# EAGLE design steamer-mainboard (EAGLE 5.11)
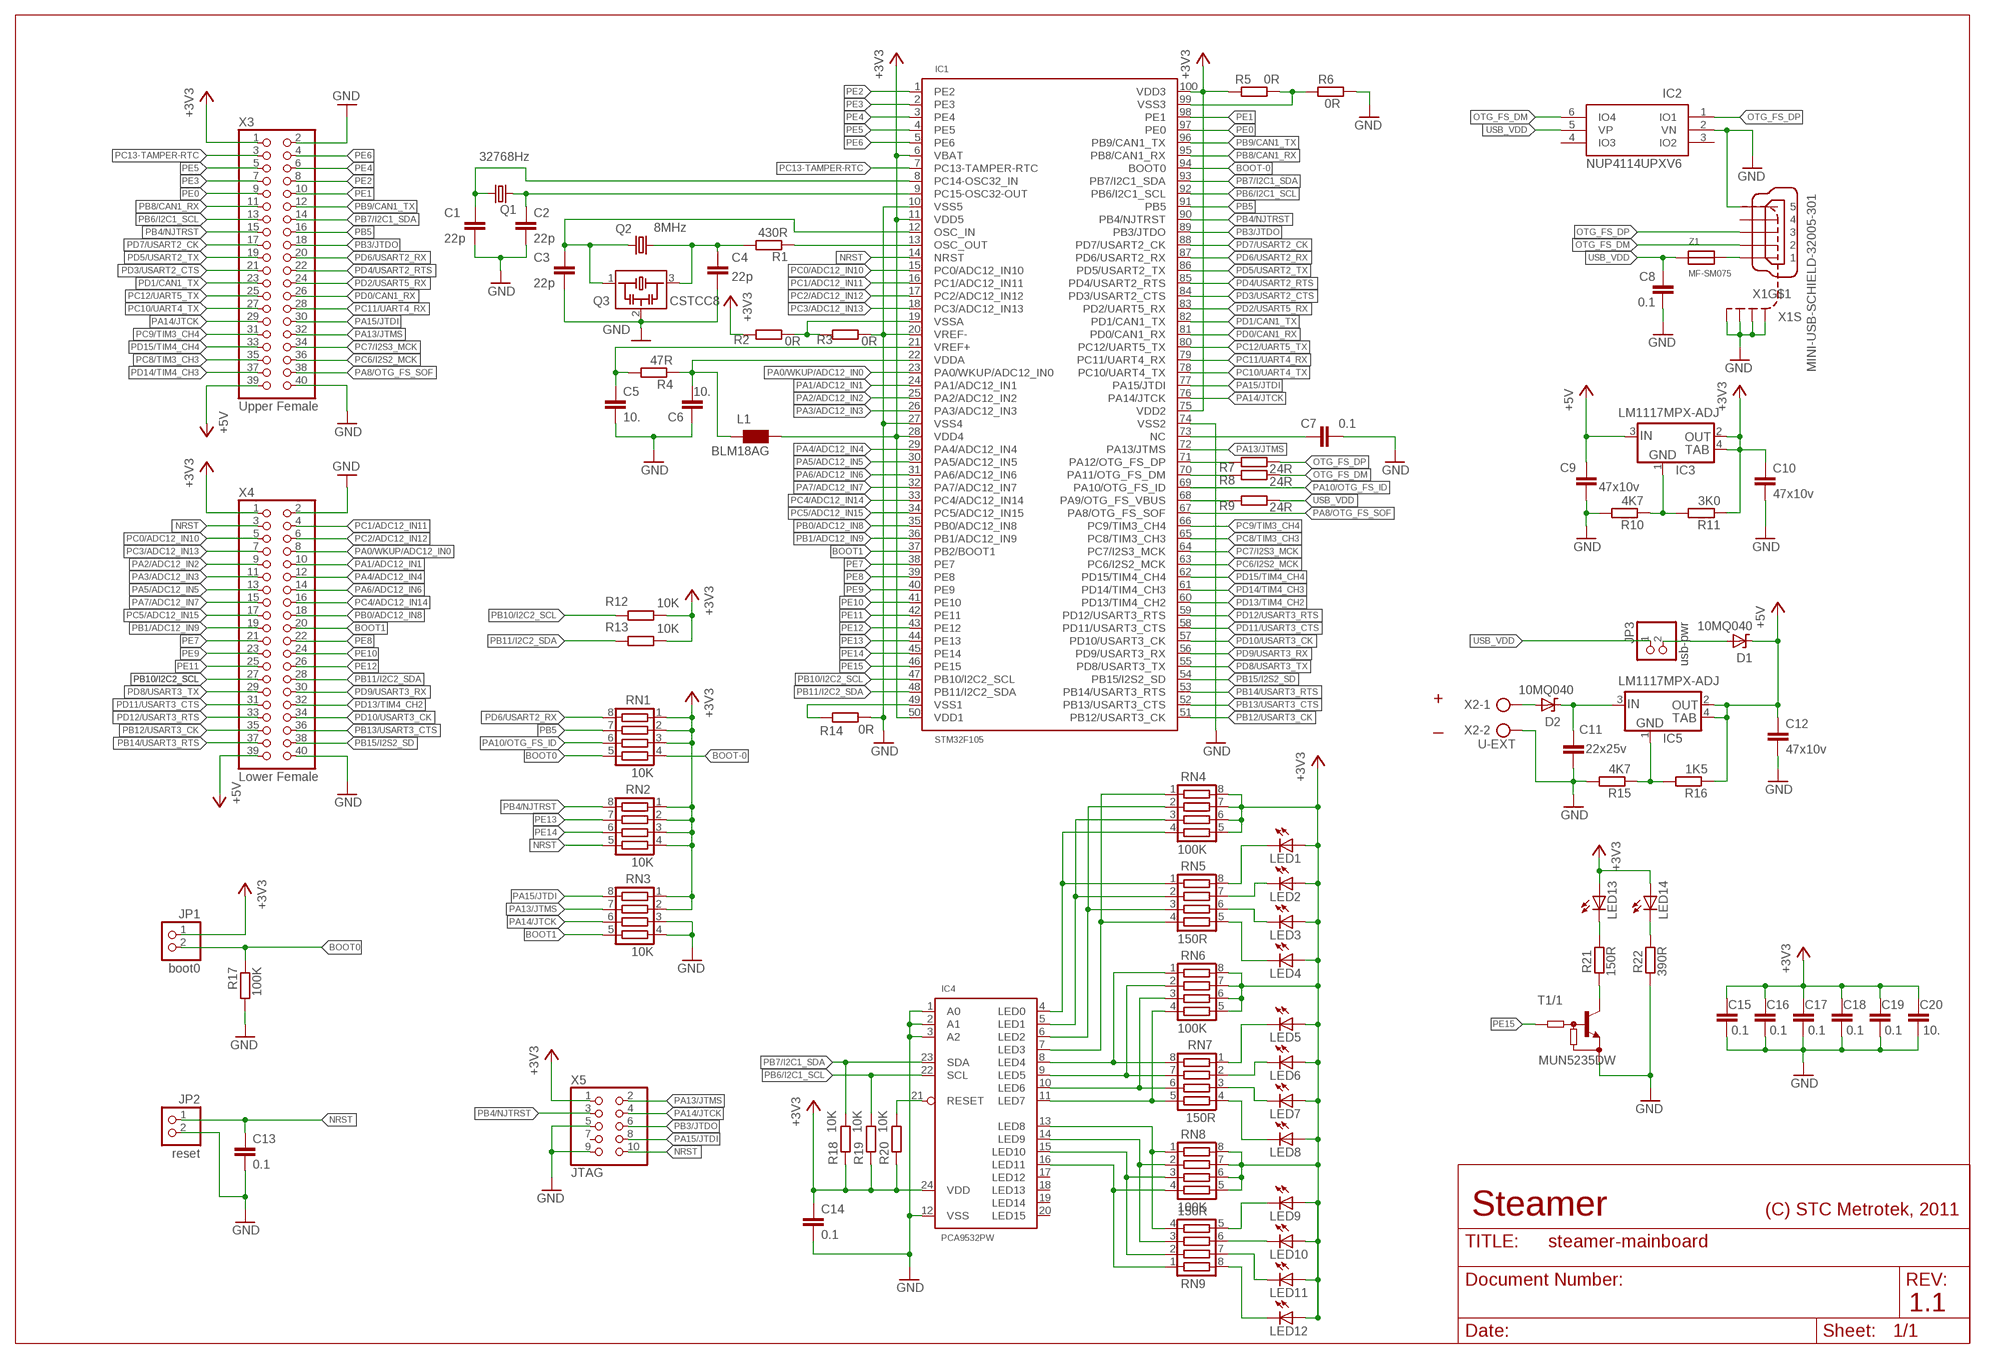
[diagram p0: schematic, sheet 1]

## Parts
C1  22p  C-EUC0603  [C0603]
C2  22p  C-EUC0603  [C0603]
C3  22p  C-EUC0603  [C0603]
C4  22p  C-EUC0603  [C0603]
C5  10.  C-EUC0603  [C0603]
C6  10.  C-EUC0603  [C0603]
C7  0.1  C-EUC0603  [C0603]
C8  0.1  C-EUC0603  [C0603]
C9  47x10v  C-EUC1210  [C1210]
C10  47x10v  C-EUC1210  [C1210]
C11  22x25v  C-EUC1210  [C1210]
C12  47x10v  C-EUC1210  [C1210]
C13  0.1  C-EUC0603  [C0603]
C14  0.1  C-EUC0603  [C0603]
C15  0.1  C-EUC0603  [C0603]
C16  0.1  C-EUC0603  [C0603]
C17  0.1  C-EUC0603  [C0603]
C18  0.1  C-EUC0603  [C0603]
C19  0.1  C-EUC0603  [C0603]
C20  10.  C-EUC0603  [C0603]
D1  10MQ040  [10MQ040]
D2  10MQ040  [10MQ040]
IC1  STM32F105  [TQFP100]
IC2  NUP4114UPXV6  [SOT-563]
IC3  LM1117MPX-ADJ  LM1117  [SOT223]
IC4  PCA9532PW  [TSSOP24]
IC5  LM1117MPX-ADJ  LM1117  [SOT223]
JP1  boot0  PINHD-1X2  [1X02]
JP2  reset  PINHD-1X2  [1X02]
JP3  usb-pwr  PINHD-1X2  [1X02]
L1  BLM18AG  WE-KIHC_0603  [WE-KI_0603_B]
LED1  LEDCHIPLED_0603  [CHIPLED_0603]
LED2  LEDCHIPLED_0603  [CHIPLED_0603]
LED3  LEDCHIPLED_0603  [CHIPLED_0603]
LED4  LEDCHIPLED_0603  [CHIPLED_0603]
LED5  LEDCHIPLED_0603  [CHIPLED_0603]
LED6  LEDCHIPLED_0603  [CHIPLED_0603]
LED7  LEDCHIPLED_0603  [CHIPLED_0603]
LED8  LEDCHIPLED_0603  [CHIPLED_0603]
LED9  LEDCHIPLED_0603  [CHIPLED_0603]
LED10  LEDCHIPLED_0603  [CHIPLED_0603]
LED11  LEDCHIPLED_0603  [CHIPLED_0603]
LED12  LEDCHIPLED_0603  [CHIPLED_0603]
LED13  LEDCHIPLED_0603  [CHIPLED_0603]
LED14  LEDCHIPLED_0603  [CHIPLED_0603]
Q1  32768Hz  CRYTALTC26H  [TC26H]
Q2  8MHz  CRYTALHC49U-V  [HC49U-V]
Q3  CSTCC8  [CSTCC8]
R1  430R  R-EU_R0603  [R0603]
R2  0R  R-EU_R0603  [R0603]
R3  0R  R-EU_R0603  [R0603]
R4  47R  R-EU_R0603  [R0603]
R5  0R  R-EU_R0603  [R0603]
R6  0R  R-EU_R0603  [R0603]
R7  24R  R-EU_R0603  [R0603]
R8  24R  R-EU_R0603  [R0603]
R9  24R  R-EU_R0603  [R0603]
R10  4K7  R-EU_R0603  [R0603]
R11  3K0  R-EU_R0603  [R0603]
R12  10K  R-EU_R0603  [R0603]
R13  10K  R-EU_R0603  [R0603]
R14  0R  R-EU_R0603  [R0603]
R15  4K7  R-EU_R0603  [R0603]
R16  1K5  R-EU_R0603  [R0603]
R17  100K  R-EU_R0603  [R0603]
R18  10K  R-EU_R0603  [R0603]
R19  10K  R-EU_R0603  [R0603]
R20  10K  R-EU_R0603  [R0603]
R21  150R  R-EU_R0603  [R0603]
R22  390R  R-EU_R0603  [R0603]
RN1  10K  CTS742C083  [CTS742C083]
RN2  10K  CTS742C083  [CTS742C083]
RN3  10K  CTS742C083  [CTS742C083]
RN4  100K  CTS742C083  [CTS742C083]
RN5  150R  CTS742C083  [CTS742C083]
RN6  100K  CTS742C083  [CTS742C083]
RN7  150R  CTS742C083  [CTS742C083]
RN8  100K  CTS742C083  [CTS742C083]
RN9  150R  CTS742C083  [CTS742C083]
T1  MUN5235DW  [SOT363_INFINEON]
X1  MINI-USB-SCHIELD-32005-301  [32005-301]
X2  U-EXT  AK500/2  [AK500/2]
X3  Upper Female  PINHD-2X20BROWNBEAR-F  [2X20SMD1-27-BB]
X4  Lower Female  PINHD-2X20BROWNBEAR-F  [2X20SMD1-27-BB]
X5  JTAG  PINHD-2X5  [2X05]
Z1  MF-SM075  [MF-SM075]

## Nets
+3V3 [+3V3]: C10.1 C14.1 C15.1 C16.1 C17.1 C18.1 C19.1 C20.1 IC1.6(VBAT) IC1.11(VDD5) IC1.28(VDD4) IC1.50(VDD1) IC1.75(VDD2) IC1.100(VDD3) IC3.2(OUT) IC3.4(TAB) IC4.24(VDD) JP1.1 L1.1 LED1.A LED2.A LED3.A LED4.A LED5.A LED6.A LED7.A LED8.A LED9.A LED10.A LED11.A LED12.A LED13.A LED14.A R2.2 R5.1 R11.1 R12.1 R13.1 R18.1 R19.1 R20.1 RN1.1 RN1.2 RN1.3 RN2.1 RN2.2 RN2.3 RN2.4 RN3.1 RN3.2 RN4.5 RN4.6 RN4.7 RN4.8 RN6.5 RN6.6 RN6.7 RN6.8 RN8.5 RN8.6 RN8.7 RN8.8 X3.1 X4.1 X5.1
+5V [+5V]: C9.1 C12.1 D1.P$1(C) IC3.3(IN) IC5.2(OUT) IC5.4(TAB) R16.1 X3.39 X4.39
BOOT0: JP1.2 R17.1 RN1.5
BOOT1: IC1.37(PB2/BOOT1) RN3.5 X4.20
BOOT-0: IC1.94(BOOT0) RN1.4
GND [GND]: C1.2 C2.2 C3.2 C4.2 C5.2 C6.2 C7.2 C8.2 C9.2 C10.2 C11.2 C12.2 C13.2 C14.2 C15.2 C16.2 C17.2 C18.2 C19.2 C20.2 IC1.10(VSS5) IC1.20(VREF-) IC1.27(VSS4) IC1.74(VSS2) IC2.2(VN) IC4.1(A0) IC4.2(A1) IC4.3(A2) IC4.12(VSS) JP2.2 Q3.2 R3.1 R6.2 R10.2 R14.2 R15.2 R17.2 R22.1 RN3.3 RN3.4 T1.4(/1:E) X1.5 X1.M1(S:S1) X1.M2(S:S2) X1.M3(S:S3) X1.M4(S:S4) X2.2 X3.2 X3.40 X4.2 X4.40 X5.5 X5.9
N$1: C1.1 IC1.8(PC14-OSC32_IN) Q1.2
N$2: C2.1 IC1.9(PC15-OSC32-OUT) Q1.1
N$3 [USB_VDD]: X1.1 Z1.P$2
N$4: LED2.C RN5.7
N$5: C3.1 IC1.12(OSC_IN) Q2.1 Q3.1
N$6: C4.1 Q2.2 Q3.3 R1.2
N$7: IC4.7(LED3) RN4.1 RN5.4
N$8: IC4.6(LED2) RN4.2 RN5.3
N$9 [+3V3]: C6.1 IC1.22(VDDA) L1.2 R4.1
N$10 [+3V3]: C5.1 IC1.21(VREF+) R4.2
N$11: IC1.71(PA12/OTG_FS_DP) R7.2
N$12: IC1.70(PA11/OTG_FS_DM) R8.2
N$13: IC1.68(PA9/OTG_FS_VBUS) R9.2
N$14: IC3.1(GND) R10.1 R11.2
N$15: IC4.5(LED1) RN4.3 RN5.2
N$16: IC4.4(LED0) RN4.4 RN5.1
N$17: LED3.C RN5.6
N$18: LED1.C RN5.8
N$19: LED4.C RN5.5
N$20: IC1.13(OSC_OUT) R1.1
N$21: LED6.C RN7.2
N$22: LED7.C RN7.3
N$23: LED5.C RN7.1
N$24: LED8.C RN7.4
N$25: LED11.C RN9.7
N$26: LED10.C RN9.6
N$27: LED12.C RN9.8
N$28: LED9.C RN9.5
N$29 [GND]: C7.1 IC1.73(NC)
N$30 [GND]: IC1.49(VSS1) R14.1
N$31 [GND]: IC1.99(VSS3) R5.2 R6.1
N$32: IC4.8(LED4) RN6.1 RN7.8
N$33: IC4.9(LED5) RN6.2 RN7.7
N$34: IC4.10(LED6) RN6.3 RN7.6
N$35: IC4.11(LED7) RN6.4 RN7.5
N$36: IC4.13(LED8) RN8.1 RN9.4
N$37: IC4.14(LED9) RN8.2 RN9.3
N$38: IC4.15(LED10) RN8.3 RN9.2
N$39: IC4.16(LED11) RN8.4 RN9.1
N$40: IC4.21(RESET) R20.2
N$41: LED13.C R21.2
N$42 [USB_VDD]: D1.P$2(A) JP3.2
N$43 [SUPP]: C11.1 D2.P$1(C) IC5.3(IN)
N$44 [SUPP]: D2.P$2(A) X2.1
N$45: LED14.C R22.2
N$46: R21.1 T1.3(/1:C)
N$47 [GND]: IC1.19(VSSA) R2.1 R3.2
N$48: IC5.1(GND) R15.1 R16.2
NRST: C13.1 IC1.14(NRST) JP2.1 RN2.5 X4.3 X5.10
OTG_FS_DM: IC2.6(IO4) R8.1 X1.2
OTG_FS_DP: IC2.1(IO1) R7.1 X1.3
PA0/WKUP/ADC12_IN0: IC1.23(PA0/WKUP/ADC12_IN0) X4.8
PA1/ADC12_IN1: IC1.24(PA1/ADC12_IN1) X4.10
PA2/ADC12_IN2: IC1.25(PA2/ADC12_IN2) X4.9
PA3/ADC12_IN3: IC1.26(PA3/ADC12_IN3) X4.11
PA4/ADC12_IN4: IC1.29(PA4/ADC12_IN4) X4.12
PA5/ADC12_IN5: IC1.30(PA5/ADC12_IN5) X4.13
PA6/ADC12_IN6: IC1.31(PA6/ADC12_IN6) X4.14
PA7/ADC12_IN7: IC1.32(PA7/ADC12_IN7) X4.15
PA8/OTG_FS_SOF: IC1.67(PA8/OTG_FS_SOF) X3.38
PA10/OTG_FS_ID: IC1.69(PA10/OTG_FS_ID) RN1.6
PA13/JTMS: IC1.72(PA13/JTMS) RN3.7 X3.32 X5.2
PA14/JTCK: IC1.76(PA14/JTCK) RN3.6 X3.29 X5.4
PA15/JTDI: IC1.77(PA15/JTDI) RN3.8 X3.30 X5.8
PB0/ADC12_IN8: IC1.35(PB0/ADC12_IN8) X4.18
PB1/ADC12_IN9: IC1.36(PB1/ADC12_IN9) X4.19
PB3/JTDO: IC1.89(PB3/JTDO) X3.18 X5.6
PB4/NJTRST: IC1.90(PB4/NJTRST) RN2.8 X3.15 X5.3
PB5: IC1.91(PB5) RN1.7 X3.16
PB6/I2C1_SCL: IC1.92(PB6/I2C1_SCL) IC4.22(SCL) R19.2 X3.13
PB7/I2C1_SDA: IC1.93(PB7/I2C1_SDA) IC4.23(SDA) R18.2 X3.14
PB8/CAN1_RX: IC1.95(PB8/CAN1_RX) X3.11
PB9/CAN1_TX: IC1.96(PB9/CAN1_TX) X3.12
PB10/I2C2_SCL: IC1.47(PB10/I2C2_SCL) R12.2 X4.27
PB11/I2C2_SDA: IC1.48(PB11/I2C2_SDA) R13.2 X4.28
PB12/USART3_CK: IC1.51(PB12/USART3_CK) X4.35
PB13/USART3_CTS: IC1.52(PB13/USART3_CTS) X4.36
PB14/USART3_RTS: IC1.53(PB14/USART3_RTS) X4.37
PB15/I2S2_SD: IC1.54(PB15/I2S2_SD) X4.38
PC0/ADC12_IN10: IC1.15(PC0/ADC12_IN10) X4.5
PC1/ADC12_IN11: IC1.16(PC1/ADC12_IN11) X4.4
PC2/ADC12_IN12: IC1.17(PC2/ADC12_IN12) X4.6
PC3/ADC12_IN13: IC1.18(PC3/ADC12_IN13) X4.7
PC4/ADC12_IN14: IC1.33(PC4/ADC12_IN14) X4.16
PC5/ADC12_IN15: IC1.34(PC5/ADC12_IN15) X4.17
PC6/I2S2_MCK: IC1.63(PC6/I2S2_MCK) X3.36
PC7/I2S3_MCK: IC1.64(PC7/I2S3_MCK) X3.34
PC8/TIM3_CH3: IC1.65(PC8/TIM3_CH3) X3.35
PC9/TIM3_CH4: IC1.66(PC9/TIM3_CH4) X3.31
PC10/UART4_TX: IC1.78(PC10/UART4_TX) X3.27
PC11/UART4_RX: IC1.79(PC11/UART4_RX) X3.28
PC12/UART5_TX: IC1.80(PC12/UART5_TX) X3.25
PC13-TAMPER-RTC: IC1.7(PC13-TAMPER-RTC) X3.3
PD0/CAN1_RX: IC1.81(PD0/CAN1_RX) X3.26
PD1/CAN1_TX: IC1.82(PD1/CAN1_TX) X3.23
PD2/USART5_RX: IC1.83(PD2/UART5_RX) X3.24
PD3/USART2_CTS: IC1.84(PD3/USART2_CTS) X3.21
PD4/USART2_RTS: IC1.85(PD4/USART2_RTS) X3.22
PD5/USART2_TX: IC1.86(PD5/USART2_TX) X3.19
PD6/USART2_RX: IC1.87(PD6/USART2_RX) RN1.8 X3.20
PD7/USART2_CK: IC1.88(PD7/USART2_CK) X3.17
PD8/USART3_TX: IC1.55(PD8/USART3_TX) X4.29
PD9/USART3_RX: IC1.56(PD9/USART3_RX) X4.30
PD10/USART3_CK: IC1.57(PD10/USART3_CK) X4.34
PD11/USART3_CTS: IC1.58(PD11/USART3_CTS) X4.31
PD12/USART3_RTS: IC1.59(PD12/USART3_RTS) X4.33
PD13/TIM4_CH2: IC1.60(PD13/TIM4_CH2) X4.32
PD14/TIM4_CH3: IC1.61(PD14/TIM4_CH3) X3.37
PD15/TIM4_CH4: IC1.62(PD15/TIM4_CH4) X3.33
PE0: IC1.97(PE0) X3.9
PE1: IC1.98(PE1) X3.10
PE2: IC1.1(PE2) X3.8
PE3: IC1.2(PE3) X3.7
PE4: IC1.3(PE4) X3.6
PE5: IC1.4(PE5) X3.5
PE6: IC1.5(PE6) X3.4
PE7: IC1.38(PE7) X4.21
PE8: IC1.39(PE8) X4.22
PE9: IC1.40(PE9) X4.23
PE10: IC1.41(PE10) X4.24
PE11: IC1.42(PE11) X4.25
PE12: IC1.43(PE12) X4.26
PE13: IC1.44(PE13) RN2.7
PE14: IC1.45(PE14) RN2.6
PE15: IC1.46(PE15) T1.5(/1:B)
USB_VDD [USB_VDD]: C8.1 IC2.5(VP) JP3.1 R9.1 Z1.P$1
Unconnected: IC2.3(IO2) IC2.4(IO3) IC4.17(LED12) IC4.18(LED13) IC4.19(LED14) IC4.20(LED15) T1.1(/2:E) T1.2(/2:B) T1.6(/2:C) X1.4 X5.7

## Notes on the sheet
- +
- _
- Steamer | (C) STC Metrotek, 2011
- 1.1

## Library data of the parts
C1-C20 = rcl:C-EU: CAPACITOR, European symbol
D1 D2 = 10mq040:10MQ040
IC1 = stm32f105:STM32F105
IC2 = nup4114upx:NUP4114UPXV6
IC3 IC5 = lm1117:LM1117
IC4 = pca9532pw:PCA9532
JP1-JP3 = pinhead:PINHD-1X2: PIN HEADER
L1 = wuerth-elektronik:WE-KIHC: SMD Wire Wound Ceramic Inductor WE-KIHC - High current up to 2400 mA - Very high Q values - High thermal stability - Very high SRF - up to 12,5 GHz -- Bluetooth -- Wireless LAN -- RF oscillation circuit -- IF impedance matching -- PA chokes
LED1-LED14 = led:LED: LED OSRAM: - CHIPLED LG R971, LG N971, LY N971, LG Q971, LY Q971, LO R971, LY R971 LH N974, LH R974 LS Q976, LO Q976, LY Q976 LO Q996 - Hyper CHIPLED LW Q18S LB Q993, LB Q99A, LB R99A - SideLED LS A670, LO A670, LY A670, LG A670, LP A670 LB A673, LV A673, LT A673, LW A673 LH A674 LY A675 LS A676, LA A676, LO A676, LY A676, LW A676 LS A679, LY A679, LG A679 - Hyper Micro SIDELED® LS Y876, LA Y876, LO Y876, LY Y876 LT Y87S - SmartLED LW L88C, LW L88S LB L89C, LB L89S, LG L890 LS L89K, LO L89K, LY L89K LS L896, LA L896, LO L896, LY L896 - TOPLED LS T670, LO T670, LY T670, LG T670, LP T670 LSG T670, LSP T670, LSY T670, LOP T670, LYG T670 LG T671, LOG T671, LSG T671 LB T673, LV T673, LT T673, LW T673 LH T674 LS T676, LA T676, LO T676, LY T676, LB T676, LH T676, LSB T676, LW T676 LB T67C, LV T67C, LT T67C, LS T67K, LO T67K, LY T67K, LW E67C LS E67B, LA E67B, LO E67B, LY E67B, LB E67C, LV E67C, LT E67C LW T67C LS T679, LY T679, LG T679 LS T770, LO T770, LY T770, LG T770, LP T770 LB T773, LV T773, LT T773, LW T773 LH T774 LS E675, LA E675, LY E675, LS T675 LS T776, LA T776, LO T776, LY T776, LB T776 LHGB T686 LT T68C, LB T68C - Hyper Mini TOPLED® LB M676 - Mini TOPLED Santana® LG M470 LS M47K, LO M47K, LY M47K Source: http://www.osram.convergy.de LUXEON: - LUMILED® LXK2-PW12-R00, LXK2-PW12-S00, LXK2-PW14-U00, LXK2-PW14-V00 LXK2-PM12-R00, LXK2-PM12-S00, LXK2-PM14-U00 LXK2-PE12-Q00, LXK2-PE12-R00, LXK2-PE12-S00, LXK2-PE14-T00, LXK2-PE14-U00 LXK2-PB12-K00, LXK2-PB12-L00, LXK2-PB12-M00, LXK2-PB14-N00, LXK2-PB14-P00, LXK2-PB14-Q00 LXK2-PR12-L00, LXK2-PR12-M00, LXK2-PR14-Q00, LXK2-PR14-R00 LXK2-PD12-Q00, LXK2-PD12-R00, LXK2-PD12-S00 LXK2-PH12-R00, LXK2-PH12-S00 LXK2-PL12-P00, LXK2-PL12-Q00, LXK2-PL12-R00 Source: www.luxeon.com KINGBRIGHT: KA-3528ASYC Source: www.kingbright.com
Q1 Q2 = crystal:CRYTAL: CRYSTAL
Q3 = cstcc8:CSTCC8: Murata rezonator
R1-R22 = rcl:R-EU_: RESISTOR, European symbol
RN1-RN9 = chip-resistor-net:CTS742C083: Chip Resistor Array 4 Single Resistor Source: http://www.ctscorp.com/components/Datasheets/CTSChipArrayDs.pdf
T1 = mun5235:MUN5235DW
X1 = miniusb:MINI-USB-SCHIELD-: MINI USB-B Conector Source: www.cypressindustries.com
X2 = con-ptr500:AK500/2: CONNECTOR
X3 X4 = con-pinhd-2x20:PINHD-2X20: PIN HEADER
X5 = steamer:PINHD-2X5: PIN HEADER
Z1 = mf-sm075:MF-SM075

## Net classes
0 default: width 0.102 mm
1 GND: width 0.254 mm
2 +3V3: width 0.254 mm
3 +5V: width 0.254 mm
4 USB_VDD: width 0.254 mm
5 SUPP: width 0.305 mm

## Board
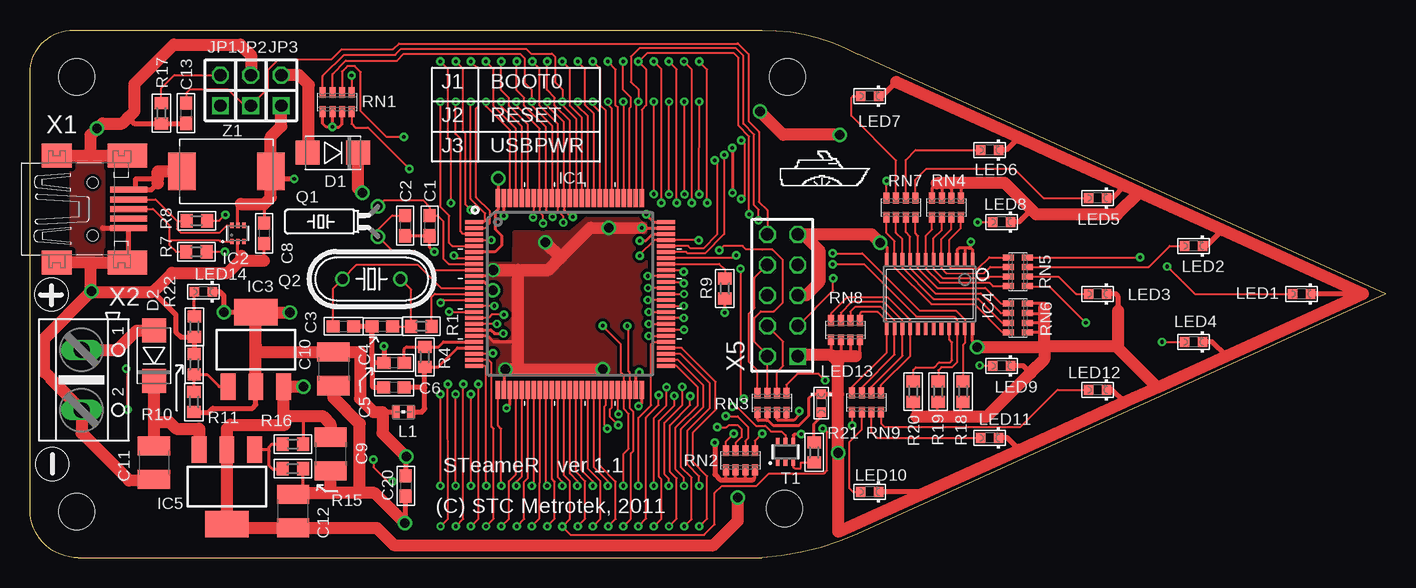
[diagram p1: board, top side]
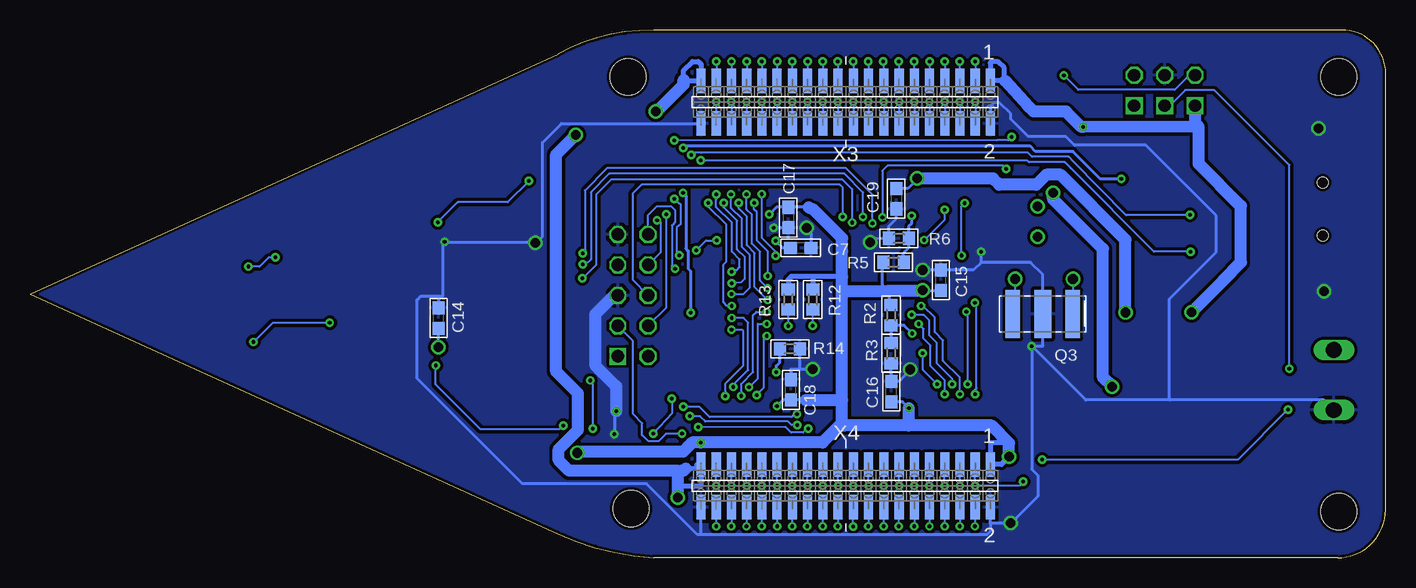
[diagram p2: board, bottom side, seen from below]

Size 113 x 44.02 mm. Coordinates in mm from the lower left corner, seen from the top.
Outline: 0,4 0,40.75 arc-90 4,44 61,44 arc-30 69,42 113,22 69,2 arc-21 61,0 4,0 arc-90 0,4
Copper layers (1*16): Top 0.035mm / dielectric 1.43mm / Bottom 0.035mm
Design rules "default *": minimum track width 0.18mm, minimum drill 0.3mm, track to track 0.2mm, track to pad 0.18mm, pad to pad 0.1mm, via to via 0.18mm, smd to smd 0.2mm, copper to edge 0.25mm, drill to drill 0.3mm, minimum pad ring 0.2mm, minimum via ring 0.2mm, stop-mask expansion 0.1mm, vias tented up to drill 0.4mm, thermal gap 12mil
Holes 3 mm at 62.9,4.1 63.15,40.1 3.9,3.85 3.9,40.1
tRestrict: area 62.1,28.6 to 70.4,34.4

### Footprints (pad centres in the part's own frame; a part is rotated, then mirrored left to right if it is on the bottom)
C0603 = smd 1.1 x 1: 1 -0.85,0; 2 0.85,0
C1210 = smd 1.6 x 2.7: 1 -1.4,0; 2 1.4,0
10MQ040 = smd 2 x 2: P$1 -2.1,0; P$2 2.1,0
TQFP100 = smd 1.5 x 0.35: 1 -8,6; 2 -8,5.5; 3 -8,5; 4 -8,4.5; 5 -8,4; 6 -8,3.5; 7 -8,3; 8 -8,2.5; 9 -8,2; 10 -8,1.5; 11 -8,1; 12 -8,0.5; 13 -8,0; 14 -8,-0.5; 15 -8,-1; 16 -8,-1.5; 17 -8,-2; 18 -8,-2.5; 19 -8,-3; 20 -8,-3.5; 21 -8,-4; 22 -8,-4.5; 23 -8,-5; 24 -8,-5.5; 25 -8,-6; 51 8,-6; 52 8,-5.5; 53 8,-5; 54 8,-4.5; 55 8,-4; 56 8,-3.5; 57 8,-3; 58 8,-2.5; 59 8,-2; 60 8,-1.5; 61 8,-1; 62 8,-0.5; 63 8,0; 64 8,0.5; 65 8,1; 66 8,1.5; 67 8,2; 68 8,2.5; 69 8,3; 70 8,3.5; 71 8,4; 72 8,4.5; 73 8,5; 74 8,5.5; 75 8,6 | smd 0.35 x 1.5: 26 -6,-8; 27 -5.5,-8; 28 -5,-8; 29 -4.5,-8; 30 -4,-8; 31 -3.5,-8; 32 -3,-8; 33 -2.5,-8; 34 -2,-8; 35 -1.5,-8; 36 -1,-8; 37 -0.5,-8; 38 0,-8; 39 0.5,-8; 40 1,-8; 41 1.5,-8; 42 2,-8; 43 2.5,-8; 44 3,-8; 45 3.5,-8; 46 4,-8; 47 4.5,-8; 48 5,-8; 49 5.5,-8; 50 6,-8; 76 6,8; 77 5.5,8; 78 5,8; 79 4.5,8; 80 4,8; 81 3.5,8; 82 3,8; 83 2.5,8; 84 2,8; 85 1.5,8; 86 1,8; 87 0.5,8; 88 0,8; 89 -0.5,8; 90 -1,8; 91 -1.5,8; 92 -2,8; 93 -2.5,8; 94 -3,8; 95 -3.5,8; 96 -4,8; 97 -4.5,8; 98 -5,8; 99 -5.5,8; 100 -6,8
SOT-563 = smd 0.3 x 0.45: 1 -0.5,-0.675; 2 0,-0.675; 3 0.5,-0.675; 4 0.5,0.675; 5 0,0.675; 6 -0.5,0.675
SOT223 = smd 1.219 x 2.235: 1 -2.311,-3.099; 2 0,-3.099; 3 2.311,-3.099 | smd 3.6 x 2.2: 4 0,3.099
TSSOP24 = smd 0.305 x 0.991: 1 -3.575,-2.918; 2 -2.925,-2.918; 3 -2.275,-2.918; 4 -1.625,-2.918; 5 -0.975,-2.918; 6 -0.325,-2.918; 7 0.325,-2.918; 8 0.975,-2.918; 9 1.625,-2.918; 10 2.275,-2.918; 11 2.925,-2.918; 12 3.575,-2.918; 13 3.575,2.918; 14 2.925,2.918; 15 2.275,2.918; 16 1.625,2.918; 17 0.975,2.918; 18 0.325,2.918; 19 -0.325,2.918; 20 -0.975,2.918; 21 -1.625,2.918; 22 -2.275,2.918; 23 -2.925,2.918; 24 -3.575,2.918
1X02 = drill 1.016 square: 1 -1.27,0 | drill 1.016 octagon: 2 1.27,0
WE-KI_0603_B = smd 0.64 x 1.02: 1 -0.64,0; 2 0.64,0
CHIPLED_0603 = smd 0.8 x 0.8: A 0,-0.75; C 0,0.75
TC26H = drill 0.813 round: 1 -1.27,0; 2 1.27,0
HC49U-V = drill 0.813 round: 1 -2.413,0; 2 2.413,0
CSTCC8 = smd 1.2 x 4: 1 -2.5,0; 3 2.5,0 | smd 1.4 x 4: 2 0,0
R0603 = smd 1 x 1.1: 1 -0.85,0; 2 0.85,0
CTS742C083 = smd 0.5 x 0.9: 1 -1.2,-0.8; 2 -0.4,-0.8; 3 0.4,-0.8; 4 1.2,-0.8; 5 1.2,0.8; 6 0.4,0.8; 7 -0.4,0.8; 8 -1.2,0.8
SOT363_INFINEON = smd 0.3 x 0.7: 1 -0.65,-0.8; 2 0,-0.8; 3 0.65,-0.8; 4 0.65,0.8; 5 0,0.8; 6 -0.65,0.8
32005-301 = smd 3.1 x 0.5: 1 3,1.6; 2 3,0.8; 3 3,0; 4 3,-0.8; 5 3,-1.6 | smd 2.5 x 2: M1 -3,-4.45; M2 -3,4.45 | smd 3.3 x 2: M3 2.9,4.45; M4 2.9,-4.45 | hole 0.9: 0,2.2; 0,-2.2
AK500/2 = drill 1.321 long: 1 -2.515,0; 2 2.515,0
2X20SMD1-27-BB = smd 0.76 x 2.05: 1 -12.065,-1.775; 2 -12.065,1.775; 3 -10.795,-1.775; 4 -10.795,1.775; 5 -9.525,-1.775; 6 -9.525,1.775; 7 -8.255,-1.775; 8 -8.255,1.775; 9 -6.985,-1.775; 10 -6.985,1.775; 11 -5.715,-1.775; 12 -5.715,1.775; 13 -4.455,-1.775; 14 -4.455,1.775; 15 -3.175,-1.775; 16 -3.175,1.775; 17 -1.905,-1.775; 18 -1.905,1.775; 19 -0.635,-1.775; 20 -0.635,1.775; 21 0.635,-1.775; 22 0.635,1.775; 23 1.905,-1.775; 24 1.905,1.775; 25 3.175,-1.775; 26 3.175,1.775; 27 4.445,-1.775; 28 4.445,1.775; 29 5.715,-1.775; 30 5.715,1.775; 31 6.985,-1.775; 32 6.985,1.775; 33 8.255,-1.775; 34 8.255,1.775; 35 9.525,-1.775; 36 9.525,1.775; 37 10.795,-1.775; 38 10.795,1.775; 39 12.065,-1.775; 40 12.065,1.775
2X05 = drill 1.016 square: 1 -5.08,-1.27 | drill 1.016 octagon: 2 -5.08,1.27; 3 -2.54,-1.27; 4 -2.54,1.27; 5 0,-1.27; 6 0,1.27; 7 2.54,-1.27; 8 2.54,1.27; 9 5.08,-1.27; 10 5.08,1.27
MF-SM075 = smd 2.3 x 3.1: P$1 -3.7,0; P$2 3.7,0

### Placement (x,y rotation side)
C1  33.33,27.7 270 top
C2  31.28,27.7 270 top
C3  26.13,19.31 0 top
C4  29.38,19.3 180 top
C5  30.35,16.25 180 top
C6  30.34,14.21 180 top
C7  48.75,25.85 0 bottom
C8  19.51,27.06 270 top
C9  25.06,8.66 270 top
C10  25.3,15.76 270 top
C11  10.33,7.94 270 top
C12  21.94,3.89 90 top
C13  13,37.07 270 top
C14  78.94,19.98 90 bottom
C15  37.06,23.15 90 bottom
C16  41.2,13.86 90 bottom
C17  49.79,28.38 270 bottom
C18  49.58,14.01 90 bottom
C19  40.79,29.95 270 bottom
C20  31.33,5.99 270 top
D1  25.26,33.77 180 top
D2  10.34,16.85 90 top
IC1  45,22 0 top
IC2  17.32,27.05 0 top
IC3  18.83,17.37 0 top
IC4  75,22 180 top
IC5  16.42,5.92 180 top
JP1  15.88,38.99 90 top
JP2  18.41,38.99 90 top
JP3  20.95,38.99 90 top
L1  31.13,12.16 0 top
LED1  106,22 90 top
LED2  97,26 90 top
LED3  89,22 90 top
LED4  97,18 90 top
LED5  89,30 90 top
LED6  80,34 90 top
LED7  70,38.5 90 top
LED8  81,28 90 top
LED9  81,16 90 top
LED10  70,5.5 90 top
LED11  80,10 90 top
LED12  89,14 90 top
LED13  65.97,12.89 180 top
LED14  14.45,22.18 90 top
Q1  29.01,28.04 90 top
Q2  28.47,23.25 0 top
Q3  28.57,20.33 180 bottom
R1  32.63,19.3 180 top
R2  41.22,20.24 90 bottom
R3  41.21,17.05 90 bottom
R4  32.91,16.75 90 top
R5  41.01,24.64 0 bottom
R6  40.56,26.64 180 bottom
R7  13.88,25.52 0 top
R8  13.91,28.11 0 top
R9  57.92,22.46 90 top
R10  13.69,16.13 90 top
R11  13.67,13 90 top
R12  47.74,21.54 270 bottom
R13  49.79,21.54 270 bottom
R14  49.65,17.42 0 bottom
R15  21.91,7.43 0 top
R16  21.92,9.48 180 top
R17  10.95,37.07 270 top
R18  77.78,13.86 90 top
R19  75.71,13.86 90 top
R20  73.63,13.86 90 top
R21  65.37,8.79 90 top
R22  13.7,19.26 90 top
RN1  25.61,38.01 0 top
RN2  59.23,8.13 0 top
RN3  61.86,12.92 0 top
RN4  76.4,29.2 0 top
RN5  82.35,23.85 270 top
RN6  82.35,20 270 top
RN7  72.6,29.2 180 top
RN8  67.99,18.98 180 top
RN9  69.74,12.95 180 top
T1  62.98,8.83 0 top
X1  5.23,29.09 0 top
X2  4.3,14.83 270 top
X3  45,38 180 bottom
X4  45,6 180 bottom
X5  62.73,21.89 90 top
Z1  16.38,32.23 180 top

### Tracks (layer width: path | path; a pad name or v marks a point on that pad's centre or on a via)
+3V3  (via drill 0.3, 0.8)
  Top 0.254: 110.45,21.71 110.16,22 | 77.67,31.24 77.6,31.17 RN4.5 | RN4.6 76.8,31.19 76.75,31.24 | RN4.7 76,31.23 76.01,31.24 | RN4.8 75.2,30.84 75.6,31.24 | RN6.5 84.5,18.8 84.55,18.85 84.55,19.59 RN6.6 | 84.55,20.86 84.55,21.17 84.59,21.21 RN6.8 | 90.72,20.61 90.74,20.59 | RN6.7 83.22,20.33 84.55,20.33 | 73.87,11.75 73.63,11.99 R20.1 | R18.1 77.62,12.85 77.62,11.75 | R19.1 75.65,12.95 75.65,11.75 | R11.1 | IC3.4 | IC1.50 51,12.91 v50.73,12.64 | IC1.28 40,12.75 v39.73,12.48 | IC1.11 37.87,23 v38.57,22.3 | IC1.6 38.77,25.5 39.32,26.05 39.32,26.87 38.79,27.4 38.79,28.82 38.99,29.02 39,29.02 IC1.100 | IC1.100 | IC1.100 39,31.28 39.03,31.31 v39.03,31.64 | IC1.75 51.99,28 v51.36,28.63 | RN8.5 66.8,16.9 67.64,16.9 | 67.64,16.9 68.42,16.9 | 68.42,16.9 69.22,16.9 69.19,17.12 RN8.8 | RN8.7 68.42,18.15 68.42,16.9 | RN8.6 67.64,18.13 67.64,16.9 | IC4.24 78.58,18.12 v78.95,17.55 | v31.37,8.44 31.33,8.4 | RN3.1 60.66,11.51 60.72,11.45 61.4,11.45 | 61.4,11.45 61.46,11.51 RN3.2 | RN3.2 | RN2.4 60.43,6.65 60.28,6.5 | 61.4,11.45 61.53,11.45 61.98,11 64.07,11 64.91,11.84 64.91,13.3 65.25,13.64 LED13.A | RN2.3 59.63,6.54 59.59,6.5 | RN2.1 58.03,6.52 58.01,6.5 | RN2.2 58.83,6.51 58.82,6.5 | v25.21,35.92 RN1.2 | RN1.1 24.41,36.2 24.69,35.92 v25.21,35.92 | RN1.3 26.01,36.15 25.76,35.9 25.23,35.9 v25.21,35.92
  Top 0.406: LED7.A 71.01,38.5 72.19,39.68 | 74.74,5.49 LED10.A | LED5.A 90.21,30 91.24,31.03 | LED2.A 98.08,26 99.41,27.32 | 110.16,22 LED1.A | 99.71,16.83 98.54,18 LED4.A | LED6.A 81.39,34 82.42,35.03 | LED11.A 81.47,10 82.47,9 | LED8.A 82.44,28 83.48,29.04 | LED12.A 90.21,14 91.23,12.98 | 90.72,20.61 90.72,21.78 90.5,22 LED3.A | LED9.A 82.81,16 83.4,15.41 | IC3.2 18.83,12.75 18.55,12.47 15.23,12.47 14.9,12.14 R11.1 | 67.37,13.64 LED13.A | 31.33,8.4 C20.1 | 60.28,6.5 59.59,6.5 58.82,6.5 58.01,6.5 57.53,6.5 57.09,6.94 v57.09,9.61 | LED14.A 15.84,22.18 16.18,21.84 v16.18,20.47 IC3.4 | 29.38,12.16 L1.1
  Top 1.016: 92.48,30.47 99.41,27.32 111.11,22.01 110.45,21.71 99.71,16.83 93.96,14.22 | 92.48,30.47 91.24,31.03 85.33,33.71 82.42,35.03 72.19,39.68 | 93.96,14.22 91.23,12.98 82.47,9 74.74,5.49 67.37,2.17 v67.37,8.75 67.37,13.64 67.37,16.33 66.88,16.82 | 75.6,31.24 76.01,31.24 76.75,31.24 77.67,31.24 81.26,31.26 83.48,29.04 83.89,28.63 90.62,28.61 92.48,30.47 | 84.55,17.62 84.55,16.56 83.4,15.41 79.74,11.75 77.62,11.75 75.65,11.75 73.87,11.75 | 84.55,17.62 84.55,17.68 | 84.55,17.68 84.55,19.59 84.55,20.33 84.55,20.86 | 93.96,14.22 90.56,17.62 | 90.56,17.62 84.55,17.62 | 90.56,17.62 90.72,17.78 90.72,20.61 | IC3.2 18.83,17.16 | 18.83,17.72 IC3.4 v21.66,20.47 v21.67,20.46 | 18.83,17.72 18.85,17.7 | 66.88,16.82 66.8,16.9 64.09,16.9 X5.1 | 66.88,16.82 68.84,16.82 | v78.95,17.55 84.42,17.55 84.55,17.68 | v31.37,8.44 31.32,8.49 31.28,8.49 29.38,10.39 29.38,12.16 28.63,12.16 27.51,13.28 27.53,17.16 C10.1 18.83,17.16 | 18.83,17.16 18.83,17.72
  Bottom 0.254: v50.73,12.64 50.21,13.16 C18.1 47.92,13.16 48.34,13.13 | C19.1 39.82,30.8 39.03,31.59 v39.03,31.64 | 51.16,28.83 v51.36,28.63 50.76,29.23 C17.1 47.66,29.23 48.09,29.22 | C14.1 78.95,18.67 v78.95,17.55 | 41.32,13.18 C16.1 40.26,13.01 v39.73,12.48 | 31.7,39.78 31.79,39.78 31.86,39.78 | R2.2 41.41,21.05 41.41,22.25 | v38.57,22.3 C15.1 | R5.1 41.93,24.57 41.93,22.25
  Bottom 0.406: 32.95,39.82 32.95,41.28 32.86,41.37 32.3,41.37 31.79,40.85 31.79,39.78 | 32.95,39.82 32.95,39.79 X3.1 | 32.95,39.82 31.78,39.82 | 31.38,9.58 32.94,9.58 X4.1 | v31.37,8.44 32.02,7.79 X4.1 | R13.1 49.79,23.21 49.53,23.47 47.85,23.47 | 47.85,23.47 45.33,23.47 45.31,23.45 | R12.1 47.74,23.36 47.85,23.47
  Bottom 1.016: 45.31,13.13 48.34,13.13 | 45.31,22.25 41.93,22.25 41.41,22.25 41.41,22.29 v38.58,22.29 v38.57,22.3 | 45.31,13.13 45.31,22.25 | 45.31,22.25 45.31,23.45 45.31,25.55 45.3,25.56 45.3,26.65 47.65,29 48.09,29.22 | 45.31,11.23 45.31,13.13 | 45.31,11.23 46.93,9.61 v57.09,9.61 57.8,9.61 58.15,9.26 58.15,9.25 58.56,8.84 67.28,8.84 v67.37,8.75 | 15.58,35.94 v25.21,35.92 25.35,35.92 26.64,37.21 29.32,37.21 29.73,37.62 31.7,39.78 | v31.37,8.44 v31.38,8.45 31.38,9.58 32.83,11.03 39.77,11.03 | 39.77,11.03 45.11,11.03 45.31,11.23 | v39.73,12.48 39.73,11.07 39.77,11.03 | v16.18,20.47 13.5,23.15 13.5,23.18 12.05,24.63 12.05,29.34 15.58,32.87 15.58,35.94 | v21.67,20.46 21.67,26.53 27.08,31.94 28.29,31.94 29.11,31.12 32.19,31.12 32.71,31.64 v39.03,31.64 | 15.58,35.94 15.88,36.23 JP1.1
+5V  (via drill 0.8)
  Top 0.254: R16.1 22.77,11.78 22.81,11.82
  Top 1.016: 21.14,11.72 21.14,11.2 21.25,11.09 16.7,11.09 16.42,10.79 IC5.2 IC5.4 16.72,2.52 17.39,2.52 17.43,2.56 17.5,2.49 C12.1 28.91,2.49 30.34,1.06 56.99,1.06 59,3.07 v59,5.02 | 21.14,11.72 IC3.3 v22.79,14.27 | D1.P$1 27.35,30.81 v27.71,30.45 | v67.49,35.28 62.79,35.28 v60.85,37.22 | C9.1 25.06,11.14 24.38,11.82 22.81,11.82 21.24,11.82 21.14,11.72
  Bottom 0.406: 58.35,7.44 57.4,7.44 57.4,7.78 X4.39 57.06,5.95 59,5.95 | X3.39 58.51,39.78 58.51,39.86 58.51,40.66 57.79,41.38 57.29,41.38 57.06,41.15 57.06,39.81 57.07,39.8
  Bottom 1.016: 58.35,7.44 58.5,7.29 58.67,7.29 58.71,7.25 59.04,7.25 | 59.04,7.25 68.05,7.25 68.93,8.13 68.93,9.06 67.33,10.66 67.33,13.72 69.14,15.53 69.14,33.63 v67.49,35.28 | v60.85,37.22 60.76,37.22 58.51,39.47 58.51,39.86 | v27.71,30.45 27.71,29.91 23.56,25.76 23.56,15.04 v22.79,14.27 | 59.04,7.25 59,7.21 v59,5.02
BOOT0  (via drill 0.3)
  Top 0.18: v26.81,40.24 RN1.5 | R17.1 10.95,39.18 12.03,40.26 JP1.2
  Bottom 0.18: v26.81,40.24 25.61,39.04 17.57,39.04 16.35,40.26 JP1.2
BOOT1  (via drill 0.3)
  Top 0.18: IC1.37 44.5,6.89 45.01,6.38 45.01,3.23 v44.38,2.6 45.07,1.91 56.2,1.91 57.08,2.79 57.08,5.4 57.67,5.99 60.55,5.99 61.6,7.04 66.21,7.04 66.44,7.27 66.44,10.49 v66.07,10.78 | RN3.5 63.06,14.43 63.97,15.34 65.74,15.34 v66.29,14.79
  Bottom 0.18: X4.20 v44.38,2.6 | v66.29,14.79 66.07,14.59 v66.07,10.78
BOOT-0  (via drill 0.3)
  Top 0.18: IC1.94 42,28.5 v41.94,28.41 | RN1.4 26.81,36.19 27.11,35.89 28.17,35.89 v31.62,32.44
  Bottom 0.18: v41.94,28.41 41.94,32.27 41.51,32.7 31.88,32.7 v31.62,32.44
GND  (via drill 0.3, 0.8)
  Top 0.254: R22.1 | C9.2 24.89,7.53 | 27.16,19.3 C3.2 | X1.5 | 10.15,22.17 10.26,22.17 | IC2.2 17.32,25.5 17.63,25.19 | 19.51,24.77 C8.2 | IC1.27 39.5,15.18 v39.62,15.71 | IC1.10 38.1,23.5 v38.6,24 | IC1.74 51.36,27.5 v51.01,27.52 | v31.25,2.88 31.33,2.96 | 22.78,5.56 22.81,5.59 22.76,5.64 R15.2 | RN3.3 62.26,11.55 62.34,11.47 63.06,11.47 | 63.06,11.47 RN3.4 | RN3.4 | IC4.1 78.58,25.7 78.44,25.83 78.27,25.83 | 78.27,25.83 77.92,25.83 | 77.92,25.83 77.42,25.83 77.28,25.69 IC4.3 | v78.44,26.35 78.44,26 78.27,25.83 | IC4.12 71.42,25.91 71.07,26.26 v70.89,26.26 | IC4.2 77.92,25.82 77.92,25.83 | C2.2 C1.2 33.33,25.88 v33.7,25.51 | 28.54,16.25 28.53,16.26 | IC1.20 38.14,18.5 38.65,17.99 40.6,17.99 40.66,18.05 | v64.13,12.24 64.13,11.97 63.68,11.47 63.06,11.47 | T1.4 63.63,10.22 63.72,10.31 v64.28,10.31
  Top 0.305: 29.5,17.74 v29.5,17.65 v29.49,17.65
  Top 0.406: R22.1 R10.2 | 27.16,19.3 C4.2 28.53,16.26 28.53,14.33 28.65,14.21 C6.2 | 10.26,22.17 12.16,20.27 12.16,18.83 12.59,18.4 R22.1 | 31.33,2.96 C20.2 | 28.54,16.25 C5.2 29.5,17.74 | R17.2 C13.2 | R17.2 | R17.2 8.69,36.22 8.19,36.73 | X1.5 8.23,24.64 X1.M4 | 6.03,27.5 7.12,27.5
  Top 1.016: C11.2 8.26,6.44 4.3,10.4 X2.2 | X2.2 | X2.2 4.3,12.35 1.75,14.9 | 5.06,22.15 5.06,24.51 | 5.06,22.15 10.13,22.15 10.15,22.17 | 17.63,24.9 17.63,25.19 | 17.63,24.9 16.49,23.76 11.85,23.76 10.26,22.17 | 19.51,24.77 17.76,24.77 17.63,24.9 | X5.5 64.7,21.89 65.81,23 65.81,25.64 64.48,26.97 X5.9 70.18,26.97 v70.89,26.26 | 22.78,5.56 C12.2 22.04,5.39 25.07,5.39 25.05,5.41 | 40.66,15.71 v39.62,15.71 | 40.66,15.71 v47.76,15.72 | v51.01,27.52 v48.25,27.51 46.73,27.52 44.24,25.04 | 44.24,25.04 43.21,24 40.66,24 | 40.66,15.71 40.66,18.05 40.66,24 | v38.6,24 40.66,24 | v42.95,26.31 44.23,25.04 44.24,25.04 | 5.06,22.15 1.17,18.26 1.17,15.48 1.21,15.48 1.75,14.94 1.75,14.9 | 1.75,14.9 1.79,14.9 | 5.06,33.57 5.06,33.45 4.97,33.54 X1.M2 | 5.06,33.57 5.06,35.25 6.03,36.22 7.68,36.22 8.19,36.73 8.71,37.25 8.71,39.53 11.98,42.8 17.54,42.8 18.42,41.92 JP2.2 | C10.2 25.3,13.36 27.48,11.18 27.48,5.49 27.56,5.41 | 27.56,5.41 25.05,5.41 | 27.56,5.41 28.72,5.41 v31.25,2.88 | C9.2 25.06,5.42 25.05,5.41 | X1.M3 5.09,33.54 5.06,33.57 | X1.M1 4.93,24.64 5.06,24.51 | X1.M4 5.19,24.64 5.06,24.51
  Bottom 0.254: v39.62,15.71 40.39,14.87 40.55,14.71 C16.2 | 32.94,2.86 32.92,2.88 v31.25,2.88 28.99,5.14 28.99,6.89 29.49,7.39 v29.49,17.65 25,13.16 18.01,13.16 | 32.94,2.86 X4.2 | v47.76,15.72 48.64,15.71 | 48.64,15.71 49.11,15.71 | 32.94,2.86 32.92,2.84 32.92,2.22 33.22,1.92 57.06,1.92 | C16.2 41.3,14.88 | v38.6,24 C15.2 34.34,24 33.7,24.64 | v51,27.53 v51.01,27.52 49.62,27.52 C17.2 | C19.2 40.79,28.27 41.41,27.65 R6.2 42.59,26.67 v42.95,26.31 | v64.13,12.24 64.28,12.09 v64.28,10.31 | 78.93,21.82 78.58,21.82 78.58,26.21 v78.44,26.35 70.98,26.35 v70.89,26.26 70.82,26.26 70.29,26.79 70.29,34.64 68.7,36.23 X3.40 | X3.2 32.94,37.69 32.66,37.96 32.19,37.96 31.25,37.02 31.25,36.6 29.79,35.14 26.66,35.14 25.92,34.4 19.97,34.4 14.11,28.54 14.11,25.5 18.03,21.58 18.03,13.18 18.01,13.16 | 33.7,24.64 v33.7,25.51 | 18.01,13.16 5.14,13.16 X2.2 | 57.06,1.92 57.34,1.92 61.59,6.17 71.95,6.17 80.75,14.97 80.75,21.5 80.43,21.82 78.93,21.82 | X4.40 57.06,1.93 57.06,1.92 | C16.2 R3.1 | 78.93,21.82 C14.2 | v48.25,27.51 47.9,27.16 C7.2 | C18.2 49.58,15.71 48.79,15.71 | 48.64,15.71 48.79,15.71 | R14.2 48.8,15.72 48.79,15.71 | 33.7,24.64 29.6,24.64 28.57,23.61 Q3.2 28.57,17.72 28.53,17.68 29.46,17.68
  Bottom 1.016: X5.5 64.3,21.89 65.89,20.3 65.89,16.06 64.13,14.3 v64.13,12.24
  other vias: 5.14,22.22 5.58,35.82
  pour Bottom (isolate 0.254): 3.83,43.98 61.41,44.02 67.76,42.6 112.79,22 68.21,1.65 60.98,0.01 3.99,0 1.27,1.24 -0.06,4.01 0,40.19 1.14,42.85 2.74,43.58 3.73,43.98
  pour Top (isolate 0.254): 38.24,24.52 38.24,15.33 51.49,15.32 51.35,28.29 46.33,28.31 44.97,27.15 40.33,27.15 40.27,24.54
  pour Top: 3.48,33.73 6.13,33.73 6.13,24.36 3.44,24.36 3.44,33.75
N$1
  Top 0.18: Q1.2 29.52,29.82 32.75,29.82 33.33,29.24 C1.1 33.97,28.55 34.45,28.07 34.45,24.96 34.91,24.5 IC1.8
N$2
  Top 0.18: C2.1 30.19,28.55 29.01,27.37 Q1.1 30.17,25.61 32.08,25.61 33.69,24 IC1.9
N$3
  Top 0.406: 10.64,31.22 10.11,30.69 X1.1 | 8.78,30.68 8.78,31.57 10.7,31.57 10.7,31.59 10.66,31.59
  Top 1.016: 10.64,31.22 10.66,31.24 10.66,31.59 10.66,32.23 Z1.P$2
N$4
  Top 0.18: RN5.7 93.26,24.25 95.01,26 LED2.C
N$5
  Top 0.18: IC1.12 34.26,22.5 32.32,24.44 27.25,24.44 Q2.1 25.28,22.47 C3.1
  Bottom 0.18: Q3.1 26.06,20.33 Q2.1
N$6
  Top 0.18: C4.1 R1.2 31.78,22.35 Q2.2
  Bottom 0.18: Q3.3 30.88,20.33 Q2.2
N$7
  Top 0.18: RN4.1 75.2,27.39 74.68,26.87 IC4.7 74.68,24.1 75.84,22.94 79.96,22.94 80.25,22.65 RN5.4
N$8
  Top 0.18: RN4.2 76,27.34 75.32,26.66 IC4.6 75.32,24.09 76.08,23.33 79.9,23.33 80.02,23.45 RN5.3
N$9
  Top 0.254: IC1.22 35.64,17.5 34.04,15.9 R4.1 | 32.91,14.19 32.89,14.21
  Top 0.406: R4.1 32.91,14.19 32.91,12.42 32.65,12.16 L1.2 | 32.89,14.21 C6.1
N$10
  Top 0.254: IC1.21 34.47,18 34.07,17.6 R4.2 31.4,17.6 31.2,17.4 C5.1
N$11  (via drill 0.3)
  Top 0.18: R7.2 v16.25,25.52 | v57.08,33.13 57.27,32.9 57.28,27.47 57.28,26.96 56.13,25.81 55.05,25.81 54.86,26 IC1.71
  Bottom 0.18: v16.25,25.52 19.31,25.52 26.25,32.49 26.74,32.98 29.72,32.98 29.87,33.13 v57.08,33.13
N$12  (via drill 0.3)
  Top 0.18: R8.2 15.78,28.11 v16.28,28.61 | v57.86,33.61 v57.87,33.6 57.87,26.99 56.26,25.38 54.81,25.38 54.69,25.5 IC1.70
  Bottom 0.18: v57.86,33.61 v57.86,33.62 57.7,33.78 57.06,33.78 57.05,33.77 57.05,33.78 29.81,33.78 29.47,33.44 26.41,33.44 26.01,33.04 21.63,28.58 16.31,28.58 v16.28,28.61
N$13
  Top 0.18: IC1.68 57.44,24.5 57.92,24.02 R9.2
N$14
  Top 0.254: R10.1 13.69,13.87 R11.2 | IC3.1 15.77,14.27 14.76,15.28 R10.1 | R10.1
N$15
  Top 0.18: RN4.3 76.8,27.41 75.97,26.58 IC4.5 75.97,24.16 76.41,23.72 79.53,23.73 80.06,24.26 RN5.2
N$16
  Top 0.18: RN4.4 77.6,27.5 76.63,26.53 IC4.4 76.63,24.28 76.79,24.12 79.03,24.11 79.97,25.05 RN5.1
N$17
  Top 0.18: RN5.6 85.74,23.45 87.19,22 LED3.C
N$18  (via drill 0.3)
  Top 0.18: LED1.C 97.09,22 v94.8,24.29 | RN5.8 v92.54,25.05 | RN5.8
  Bottom 0.18: v94.8,24.29 93.86,24.29 93.1,25.05 v92.54,25.05
N$19  (via drill 0.3)
  Top 0.18: RN5.5 83.17,22.63 84.99,22.63 v88.02,19.6 | v94.36,18 LED4.C
  Bottom 0.18: v88.02,19.6 92.76,19.6 v94.36,18
N$20
  Top 0.18: IC1.13 33.73,22 33.48,21.75 R1.1
N$21
  Top 0.18: LED6.C 73.83,34 73,33.17 RN7.2
N$22
  Top 0.18: LED7.C 68.6,38.5 68.47,38.37 68.47,36.87 72.2,33.14 RN7.3
N$23
  Top 0.18: LED5.C 84.48,30 82.04,32.44 74.71,32.44 73.8,31.53 RN7.1
N$24  (via drill 0.3)
  Top 0.18: LED8.C 79.03,28 v79.01,27.98 | RN7.4 v71.4,31.42
  Bottom 0.18: v79.01,27.98 77.34,29.65 73.17,29.65 v71.4,31.42
N$25
  Top 0.18: LED11.C 70.62,10 70.14,10.48 RN9.7
N$26
  Top 0.18: LED10.C 68.62,5.5 68.31,5.81 68.31,9.65 69.35,10.69 RN9.6
N$27
  Top 0.18: LED12.C 85.65,14 82.56,10.91 71.23,10.91 70.94,11.2 RN9.8
N$28  (via drill 0.3)
  Top 0.18: LED9.C 80.21,16.04 v79.18,16.04 | RN9.5 v68.54,11.03
  Bottom 0.18: v79.18,16.04 79.18,14.46 75.44,10.72 68.85,10.72 v68.54,11.03
N$29  (via drill 0.3)
  Top 0.254: IC1.73 51.9,27 51.35,26.45 v50.84,26.45
  Bottom 0.254: v50.84,26.45 50.24,25.85 C7.1
N$30  (via drill 0.3)
  Top 0.254: IC1.49 50.5,15.18 v50.78,15.46 v50.78,15.47
  Bottom 0.254: 50.81,15.5 v50.78,15.47 50.78,16 50.5,16.28 R14.1
N$31  (via drill 0.3)
  Top 0.254: v39.5,28.52 IC1.99
  Bottom 0.254: 39.49,28.28 39.5,28.29 v39.5,28.52 39.5,27.89 39.71,27.68 R6.1 39.71,25.88 40.18,25.41 40.18,24.66 R5.2
N$32
  Top 0.18: RN7.8 73.8,27.08 74.03,26.85 IC4.8 74.03,24.12 75.64,22.51 79.64,22.51 80.95,21.2 RN6.1
N$33
  Top 0.18: RN7.7 73,27.15 73.37,26.78 IC4.9 73.37,24.16 75.47,22.06 79.26,22.06 80.92,20.4 RN6.2
N$34
  Top 0.18: RN7.6 72.2,27.09 72.72,26.57 IC4.10 72.72,24.2 75.32,21.6 79.06,21.6 81.06,19.6 RN6.3
N$35
  Top 0.18: RN7.5 71.4,27.08 72.07,26.41 IC4.11 72.07,24.22 75.14,21.15 78.71,21.15 81.06,18.8 RN6.4
N$36
  Top 0.18: RN9.4 68.54,14.24 71.43,17.13 IC4.13 71.43,19.73 70.67,20.49 69.29,20.49 69.19,20.39 RN8.1
N$37
  Top 0.18: RN9.3 69.34,14.2 72.08,16.94 IC4.14 72.07,19.77 70.92,20.92 68.78,20.92 68.39,20.53 RN8.2
N$38
  Top 0.18: RN9.2 70.14,14.26 72.73,16.85 IC4.15 72.72,19.78 71.18,21.32 68.49,21.32 67.59,20.42 RN8.3
N$39
  Top 0.18: RN9.1 70.94,14.4 73.38,16.84 IC4.16 73.37,19.86 71.53,21.7 68.12,21.7 66.79,20.37 RN8.4
N$40
  Top 0.18: IC4.21 76.62,18.21 76.87,17.97 76.87,16.46 76.71,16.3 75.79,16.3 75.38,15.89 73.85,15.89 73.64,15.68 R20.2
N$41
  Top 0.254: LED13.C 65.97,11.78 65.37,11.18 R21.2
N$42
  Top 1.016: D1.P$2 23.23,34.28 23.23,39.45 22.42,40.26 JP3.2
N$43
  Top 1.016: 10.34,11.32 10.34,9.45 C11.1 | 10.34,11.32 D2.P$1 | IC5.3 14.11,10.73 14.09,10.75 12.19,10.75 11.62,11.32 10.34,11.32
N$44
  Top 1.016: D2.P$2 8.9,18.95 7.28,17.33 4.31,17.33 X2.1
N$45
  Top 0.254: R22.2 LED14.C
N$46
  Top 0.18: T1.3 63.63,7.57 63.74,7.46 64.26,7.46 64.26,7.94 R21.1
N$47  (via drill 0.3)
  Top 0.254: IC1.19 38.41,19 38.71,18.7 v39.44,18.7 v39.45,18.71
  Bottom 0.254: 41.09,18.11 41.29,17.91 R3.2 R2.1 40.13,19.39 v39.45,18.71
N$48
  Top 0.254: R16.2 20.16,9.48 19.94,9.26 19.94,8.9 | 19.94,8.9 19.94,7.68 20.19,7.43 R15.1 | IC5.1 19.82,9.02 19.94,8.9
NRST  (via drill 0.3)
  Top 0.18: v34.21,6 v34.21,13.64 | IC1.14 34.47,21.5 v34.23,21.26 | X5.10 61.46,28.98 60.77,29.67 60.77,35.54 59.91,36.4 59.91,42.01 59.04,42.88 58.97,42.88 58.96,42.89 30.76,42.89 30.27,42.4 25.96,42.4 25.14,41.58 20.72,41.58 19.85,40.71 19.85,39.09 19.79,39.09 JP2.1 17.89,37.71 16.54,39.06 13.32,39.06 13,38.74 C13.1 | RN2.5 60.43,9.76 v61.03,10.36 | v8.13,12.36 8.13,15.65 v8.02,15.76 | C13.1 | v59.23,24.09 59.23,13.54 v59.5,13.27 | v30.21,6.34 29.86,6.34 28.64,7.56 v28.64,8.18
  Bottom 0.18: X4.3 34.24,7.74 34.24,6.03 v34.21,6 30.54,6 v30.21,6.33 v30.21,6.34 | v34.21,13.64 34.22,13.66 | v34.21,13.64 34.18,13.64 | X5.10 61.46,28.6 60.73,29.33 59.56,29.33 59.23,29 59.23,27.98 59.5,27.71 59.5,24.36 v59.23,24.09 | v61.03,10.36 59.5,12.03 v59.5,13.27 | v8.02,15.76 8.02,32.75 14.28,39.01 16.7,39.01 17.99,37.72 JP2.1 | v34.23,21.26 34.09,21.12 34.09,14.14 34.21,14.02 v34.21,13.64 | v28.64,8.18 12.31,8.18 v8.13,12.36
OTG_FS_DM
  Top 0.18: 12.26,28.1 R8.1 | 12.26,28.1 12.26,27.43 12.57,27.12 15.8,27.12 16.41,27.73 IC2.6 | 12.26,28.1 10.47,29.89 X1.2
OTG_FS_DP
  Top 0.18: X1.3 10.25,29.09 11.61,27.73 11.61,26.49 | IC2.1 15.86,26.38 15.75,26.49 11.61,26.49 | 11.61,26.49 11.61,26.09 12.18,25.52 R7.1
PA0/WKUP/ADC12_IN0  (via drill 0.3)
  Top 0.18: v36.76,2.62 37.39,3.25 37.39,14.44 v37.36,14.47 | v38.57,17.05 38.52,17 IC1.23
  Bottom 0.18: X4.8 36.76,4.21 v36.76,2.62 | v37.36,14.47 38.57,15.68 v38.57,17.05
PA1/ADC12_IN1  (via drill 0.3)
  Top 0.18: v38.02,2.62 38.66,3.26 38.66,10.76 38.54,10.88 38.5,10.88 38.47,10.91 38.47,16.25 38.21,16.51 IC1.24
  Bottom 0.18: X4.10 v38.02,2.62
PA2/ADC12_IN2  (via drill 0.3)
  Top 0.18: v38.04,6 38.04,15.9 37.93,16.01 IC1.25
  Bottom 0.18: X4.9 38.02,6.03 v38.04,6
PA3/ADC12_IN3  (via drill 0.3)
  Top 0.18: IC1.26 39,11.03 39.28,10.75 v39.28,6
  Bottom 0.18: v39.28,6 X4.11
PA4/ADC12_IN4  (via drill 0.3)
  Top 0.18: v39.29,2.62 39.93,3.26 39.93,6.38 40.5,6.95 IC1.29
  Bottom 0.18: X4.12 v39.29,2.62
PA5/ADC12_IN5  (via drill 0.3)
  Top 0.18: v40.55,6 40.55,6.35 41,6.8 IC1.30
  Bottom 0.18: X4.13 v40.55,6
PA6/ADC12_IN6  (via drill 0.3)
  Top 0.18: v40.59,2.62 41.2,3.23 41.2,6.35 41.5,6.65 IC1.31
  Bottom 0.18: X4.14 40.59,4.18 v40.59,2.62
PA7/ADC12_IN7  (via drill 0.3)
  Top 0.18: v41.84,6 42,6.16 IC1.32
  Bottom 0.18: X4.15 41.83,6.01 v41.84,6
PA8/OTG_FS_SOF  (via drill 0.3)
  Top 0.18: v55.8,38.04 v55.79,30.33 v55.8,30.32 | IC1.67 54.36,23.99 v54.51,23.84
  Bottom 0.18: X3.38 v55.8,38.03 v55.8,38.04 | v55.8,30.32 55.8,29.88 55.81,29.87 55.81,29.26 54.5,27.95 54.5,25.54 53.84,24.88 53.84,24.23 54.07,24 54.5,24 v54.51,23.84
PA10/OTG_FS_ID  (via drill 0.3)
  Top 0.18: RN1.6 26.01,40.55 26.47,41.01 27.07,41.01 27.57,40.51 27.57,37.24 29.7,35.11 v31.18,35.11 | IC1.69 58.73,25 v58.87,25.23 | v59.3,29.92 59.55,30.11 59.55,34.54 v59.29,34.8
  Bottom 0.18: v58.87,25.23 59.09,25.4 59.09,27.53 58.88,27.72 58.79,27.81 58.79,29.51 v59.3,29.92 | v59.29,34.8 32.41,34.83 31.46,34.83 v31.18,35.11
PA13/JTMS  (via drill 0.3)
  Top 0.18: v52.01,38.04 v52.01,30.34 v52,30.33 | IC1.72 | RN3.7 X5.2 | X5.2 | X5.2 61.46,16.93 60.38,18.01 60.38,20 60.93,20.55 62,20.55 62.76,21.31 62.76,24.83 61.89,25.7 61.03,25.7 61.02,25.71 59.69,25.71 59.4,26 57.83,26 v57.47,25.64 v57.47,25.63 | v55.75,26.47 55.72,26.5 IC1.72 | IC1.72 52.05,26.5 50.83,25.28 v50.83,25.19
  Bottom 0.18: X3.32 51.98,38.02 v52.01,38.04 | v57.47,25.63 56.63,26.47 v55.75,26.47 | v52,30.33 52,26.67 50.83,25.5 v50.83,25.19
PA14/JTCK  (via drill 0.3)
  Top 0.18: IC1.76 51,37.37 51.37,37.74 51.37,40.73 v50.72,41.38 51.44,42.1 58.67,42.1 59.07,41.7 59.07,36.02 59.95,35.14 v59.95,28.65 | RN3.6 62.26,15.48 62.78,16 62.78,18.03 X5.4
  Bottom 0.18: X3.29 v50.72,41.38 | X5.4 59.95,20.87 v59.95,28.65
PA15/JTDI  (via drill 0.3)
  Top 0.18: IC1.77 50.5,37.82 v50.72,38.04 50.72,39.08 50.1,39.67 50.1,41.81 50.81,42.49 58.86,42.49 59.47,41.88 59.47,36.19 60.36,35.3 60.36,29.4 60.73,29.03 v60.73,28.15 | RN3.8 60.66,15.62 59.95,16.33 59.95,20.39 60.4,20.84 60.4,23.37 X5.8
  Bottom 0.18: X3.30 v50.72,38.03 v50.72,38.04 | X5.8 60.4,25.48 60.4,27.98 60.56,27.98 v60.73,28.15
PB0/ADC12_IN8  (via drill 0.3)
  Top 0.18: v43.11,2.62 43.74,3.25 43.74,6.35 43.5,6.59 IC1.35
  Bottom 0.18: X4.18 43.09,2.63 v43.11,2.62
PB1/ADC12_IN9  (via drill 0.3)
  Top 0.18: v44.37,6 44.37,6.35 44,6.72 IC1.36
  Bottom 0.18: X4.19 v44.37,6
PB3/JTDO  (via drill 0.3)
  Top 0.18: v43.11,38.04 43.11,37.72 44.5,36.33 IC1.89 44.5,29.02 45.1,28.42 v45.25,28.42
  Bottom 0.18: X3.18 43.09,38.02 v43.11,38.04 | X5.6 62.76,23.19 62.76,30.38 62.02,31.12 45.49,31.12 45.25,30.88 v45.25,28.42
PB4/NJTRST  (via drill 0.3)
  Top 0.18: v41.87,41.38 42.47,40.78 42.47,37.71 44,36.18 IC1.90 44,28.92 44.46,28.46 v44.46,27.96 | v66.95,23.3 66.95,22.3 X5.3 | v58.65,10.34 58.03,9.72 RN2.8
  Bottom 0.18: X3.15 41.87,39.82 v41.87,41.38 | v44.46,27.96 44.46,30.76 45.31,31.57 64.54,31.57 65.79,30.32 65.79,24.45 v66.94,23.3 v66.95,23.3 | X5.3 62.75,18.1 62.75,12.01 61.96,11.22 61.96,10.2 61.93,10.17 61.91,10.17 61.45,9.71 60.62,9.71 59.99,10.34 v58.65,10.34
PB5  (via drill 0.3)
  Top 0.18: IC1.91 43.5,36.06 41.84,37.72 v41.84,38.04 v41.83,38.05 41.83,39.02 41.21,39.64 41.21,41.67 40.86,42.02 31.16,42.02 30.61,41.47 26.33,41.47 25.21,40.35 RN1.7
  Bottom 0.18: X3.16 41.83,38.02 v41.84,38.04
PB6/I2C1_SCL  (via drill 0.3)
  Top 0.18: R19.2 75.71,15.64 75.96,15.89 76.87,15.89 77.28,16.3 IC4.22 77.28,19.84 77.01,20.11 73.88,20.11 69.5,24.49 v66.92,24.49 67.37,24.49 | v40.57,41.38 40.55,41.36 40.55,39.01 41.2,38.36 41.2,37.72 43,35.92 IC1.92 43,29 v43.56,28.44
  Bottom 0.18: X3.13 40.57,39.8 v40.57,41.38 | v43.56,28.44 43.56,30.46 45.12,32.02 64.72,32.02 66.25,30.49 66.25,24.88 66.64,24.49 v66.92,24.49 | v66.92,24.49 66.88,24.53 | v66.92,24.49 66.69,24.49
PB7/I2C1_SDA  (via drill 0.3)
  Top 0.18: v40.55,38.04 40.55,37.71 42.49,35.77 IC1.93 42.5,28.81 42.77,28.54 v42.77,27.88 | R18.2 77.78,17.76 77.92,17.91 IC4.23 77.93,19.89 77.2,20.62 74.16,20.62 69.39,25.39 v66.93,25.39
  Bottom 0.18: X3.14 v40.55,38.03 v40.55,38.04 | v42.77,27.88 42.77,30.28 44.99,32.5 64.88,32.5 66.74,30.64 66.74,25.58 v66.93,25.39
PB8/CAN1_RX  (via drill 0.3)
  Top 0.18: IC1.95 41.5,36.11 39.92,37.69 39.92,38.34 39.28,38.98 39.28,41.36 v39.3,41.38
  Bottom 0.18: X3.11 39.3,39.79 v39.3,41.38
PB9/CAN1_TX  (via drill 0.3)
  Top 0.18: v39.29,38.04 39.29,37.68 41,35.97 IC1.96
  Bottom 0.18: X3.12 v39.28,38.03 v39.29,38.04
PB10/I2C2_SCL  (via drill 0.3)
  Top 0.18: v49.47,6 49.47,8.66 49.91,9.1 49.91,12.01 49.5,12.42 IC1.47 49.5,15.22 49.27,15.45 49.27,17.81 v47.74,19.34
  Bottom 0.18: X4.27 49.47,7.75 v49.47,6 | v47.74,19.34 R12.2
PB11/I2C2_SDA  (via drill 0.3)
  Top 0.18: v49.46,2.62 50.1,3.26 50.1,8.71 50.31,8.92 50.31,12.16 50,12.47 IC1.48 50,15.44 49.9,15.54 49.9,19.22 v49.79,19.33
  Bottom 0.18: X4.28 v49.46,2.62 | v49.79,19.33 R13.2
PB12/USART3_CK  (via drill 0.3)
  Top 0.18: v54.52,6 54.52,6.67 53.82,7.37 53.82,10.86 55.68,12.72 55.68,14.2 53.88,16 IC1.51
  Bottom 0.18: X4.35 v54.52,6
PB13/USART3_CTS  (via drill 0.3)
  Top 0.18: v54.54,2.62 55.16,3.22 55.16,6.69 54.29,7.56 54.29,10.74 56.14,12.59 56.14,14.37 54.01,16.5 IC1.52
  Bottom 0.18: X4.36 54.54,4.21 v54.54,2.62
PB14/USART3_RTS  (via drill 0.3)
  Top 0.18: v55.79,6 55.79,6.81 54.8,7.8 54.8,10.61 56.67,12.48 56.67,14.54 54.22,16.99 IC1.53
  Bottom 0.18: X4.37 v55.8,6 v55.79,6
PB15/I2S2_SD  (via drill 0.3)
  Top 0.18: v55.8,2.62 56.44,3.26 56.44,6.81 55.26,7.99 55.26,10.44 57.16,12.34 57.16,14.67 54.33,17.5 IC1.54
  Bottom 0.18: X4.38 v55.8,2.62
PC0/ADC12_IN10  (via drill 0.3)
  Top 0.18: v35.48,6 v35.48,13.64 | v38.72,21 IC1.15
  Bottom 0.18: X4.5 v35.48,6 | v35.48,13.64 v35.49,13.65 35.49,15.04 36.88,16.43 36.88,18.13 37.58,18.83 37.58,20.02 38.56,21 v38.72,21
PC1/ADC12_IN11  (via drill 0.3)
  Top 0.18: v34.23,2.62 34.84,3.23 34.84,5.18 v34.83,14.48 | IC1.16 v34.95,20.5 v34.94,20.51
  Bottom 0.18: X4.4 34.23,4.2 v34.23,2.62 | v34.82,14.49 v34.83,14.48 34.83,20.4 v34.94,20.51
PC2/ADC12_IN12  (via drill 0.3)
  Top 0.18: v35.5,2.62 36.12,3.24 v36.12,14.48 | v39.49,20.28 38.49,20.28 38.21,20 IC1.17
  Bottom 0.18: X4.6 35.5,4.2 v35.5,2.62 | v39.49,20.28 39.45,20.24 38.5,20.24 38.03,19.77 38.03,18.55 37.4,17.92 37.4,16.21 36.12,14.93 v36.12,14.48
PC3/ADC12_IN13  (via drill 0.3)
  Top 0.18: v36.76,6 v36.76,13.64 | v38.93,19.5 IC1.18
  Bottom 0.18: X4.7 36.76,7.76 v36.76,6 | v36.76,13.64 36.74,13.97 36.74,14.8 37.92,15.98 37.92,17.69 38.52,18.29 38.52,19.09 v38.93,19.5
PC4/ADC12_IN14  (via drill 0.3)
  Top 0.18: v41.84,2.62 41.84,2.67 42.47,3.3 42.47,6.24 42.5,6.27 IC1.33
  Bottom 0.18: X4.16 v41.84,2.62
PC5/ADC12_IN15  (via drill 0.3)
  Top 0.18: v43.1,6 43,6.1 IC1.34
  Bottom 0.18: X4.17 v43.09,6 v43.1,6
PC6/I2S2_MCK  (via drill 0.3)
  Top 0.18: v54.55,38.04 v54.55,30.33 v54.56,30.32 | IC1.63 v54.52,22
  Bottom 0.18: X3.36 54.52,38.02 v54.55,38.04 | v54.56,30.32 54.56,29.18 53.66,28.28 53.66,25.92 52.99,25.25 52.99,22.52 53.51,22 v54.52,22
PC7/I2S3_MCK  (via drill 0.3)
  Top 0.18: IC1.64 v51.52,22.5 | v53.27,30.32 v53.27,38.04
  Bottom 0.18: X3.34 53.27,36.25 v53.27,38.04 | v53.27,30.32 53.27,29.06 52.83,28.62 52.83,26.2 52.14,25.52 52.14,23.13 v51.52,22.5
PC8/TIM3_CH3  (via drill 0.3)
  Top 0.18: v54.52,41.38 55.18,40.72 v55.18,29.61 | IC1.65 54.42,23 v54.51,22.91
  Bottom 0.18: X3.35 v54.52,41.38 | v55.18,29.61 55.18,29.24 55.19,29.23 55.17,29.23 54.06,28.12 54.06,25.72 53.41,25.07 53.41,23.27 53.68,23 v54.51,22.91
PC9/TIM3_CH4  (via drill 0.3)
  Top 0.18: v52,41.38 52.63,40.75 v52.63,29.61 | IC1.66 v51.5,23.5
  Bottom 0.18: X3.31 51.98,41.37 v52,41.38 | v52.63,29.61 52.63,29.04 52.41,28.82 52.41,26.47 51.5,25.56 v51.5,23.5
PC10/UART4_TX  (via drill 0.3)
  Top 0.18: IC1.78 49.99,37.51 50.09,37.61 50.09,38.38 49.44,39.03 49.44,41.35 v49.47,41.38
  Bottom 0.18: X3.27 49.46,39.79 v49.47,41.38
PC11/UART4_RX  (via drill 0.3)
  Top 0.18: v49.46,38.04 49.5,38 IC1.79
  Bottom 0.18: X3.28 v49.46,38.04
PC12/UART5_TX  (via drill 0.3)
  Top 0.18: v48.17,41.38 48.83,40.72 48.83,37.72 49,37.55 IC1.80
  Bottom 0.18: X3.25 v48.17,41.38
PC13-TAMPER-RTC  (via drill 0.3)
  Top 0.18: v34.21,41.38 34.85,40.74 34.85,35.01 35.09,34.77 v35.09,29.58 | v35.34,25.21 35.55,25 IC1.7
  Bottom 0.18: X3.3 v34.2,41.38 v34.21,41.38 | v35.09,29.58 35.34,29.33 v35.34,25.21
PD0/CAN1_RX  (via drill 0.3)
  Top 0.18: v48.19,38.04 48.19,37.77 48.5,37.46 IC1.81
  Bottom 0.18: X3.26 48.17,38.02 v48.19,38.04
PD1/CAN1_TX  (via drill 0.3)
  Top 0.18: v46.92,41.38 47.56,40.74 47.56,37.72 48,37.28 IC1.82
  Bottom 0.18: X3.23 46.91,41.37 v46.92,41.38
PD2/USART5_RX  (via drill 0.3)
  Top 0.18: v46.92,38.04 46.92,37.75 47.5,37.17 IC1.83
  Bottom 0.18: X3.24 46.91,38.02 v46.92,38.04
PD3/USART2_CTS  (via drill 0.3)
  Top 0.18: v45.65,41.38 46.28,40.75 46.28,37.75 47,37.03 IC1.84
  Bottom 0.18: X3.21 45.63,41.37 v45.65,41.38
PD4/USART2_RTS  (via drill 0.3)
  Top 0.18: v45.65,38.04 45.65,37.68 46.5,36.83 IC1.85
  Bottom 0.18: X3.22 45.63,38.02 v45.65,38.04
PD5/USART2_TX  (via drill 0.3)
  Top 0.18: v44.38,41.38 45.02,40.74 45.02,37.7 46,36.72 IC1.86
  Bottom 0.18: X3.19 44.37,41.37 v44.38,41.38
PD6/USART2_RX  (via drill 0.3)
  Top 0.18: IC1.87 45.5,36.63 44.38,37.75 v44.38,38.04 44.38,39.05 43.75,39.68 43.75,41.8 43.5,42.05 41.76,42.05 41.36,42.45 30.94,42.45 30.47,41.98 30.47,41.95 26.17,41.95 24.41,40.19 RN1.8
  Bottom 0.18: X3.20 44.37,38.02 v44.38,38.04
PD7/USART2_CK  (via drill 0.3)
  Top 0.18: IC1.88 45,36.46 43.73,37.72 43.73,38.37 43.09,39.02 43.09,41.36 v43.11,41.38
  Bottom 0.18: X3.17 43.11,39.79 v43.11,41.38
PD8/USART3_TX  (via drill 0.3)
  Top 0.18: IC1.55 51.98,18 51.77,17.8 51.78,17.79 51.78,12.72 50.72,11.67 v50.72,6
  Bottom 0.18: v50.72,6 X4.29
PD9/USART3_RX  (via drill 0.3)
  Top 0.18: v50.72,2.62 51.37,3.27 51.37,11.7 52.41,12.74 v52.41,13.55 v52.42,13.56 | v51.58,18.5 IC1.56
  Bottom 0.18: X4.30 v50.72,2.62 | v52.42,13.56 52.42,13.59 51.82,14.19 51.82,18.5 v51.58,18.5
PD10/USART3_CK  (via drill 0.3)
  Top 0.18: v53.27,2.62 53.9,3.25 53.9,6.63 53.35,7.18 53.35,11.06 55.03,12.74 v55.03,13.49 | v54.52,19.01 IC1.57
  Bottom 0.18: X4.34 v53.27,2.62 | v54.52,19.01 v54.51,19 53.62,19 53.54,18.92 53.54,16.02 55.03,14.53 v55.03,13.49
PD11/USART3_CTS  (via drill 0.3)
  Top 0.18: v52,6 52.02,11.65 53.06,12.69 v53.06,14.22 | v51.58,19.5 IC1.58
  Bottom 0.18: X4.31 52.02,7.74 v52,6 | v51.58,19.5 52.32,19.5 52.32,14.96 v53.06,14.22
PD12/USART3_RTS  (via drill 0.3)
  Top 0.18: v53.25,6 53.25,6.6 52.88,6.97 52.88,11.25 54.39,12.76 v54.39,14.24 v54.38,14.25 | v54.49,20 IC1.59
  Bottom 0.18: X4.33 v53.26,6 v53.25,6 | v54.38,14.25 54.38,14.41 53.13,15.66 53.13,19.62 53.51,20 v54.49,20
PD13/TIM4_CH2  (via drill 0.3)
  Top 0.18: v52.01,2.62 52.63,3.24 52.63,6.55 52.43,6.75 52.43,11.43 53.71,12.71 v53.71,13.49 v53.7,13.5 | v51.58,20.5 IC1.60
  Bottom 0.18: X4.32 52.01,4.2 v52.01,2.62 | v53.7,13.5 53.7,14.5 52.72,15.48 52.72,20.23 52.45,20.5 v51.58,20.5
PD14/TIM4_CH3  (via drill 0.3)
  Top 0.18: v55.78,41.38 56.45,40.71 v56.45,29.61 | IC1.61 v54.49,21
  Bottom 0.18: X3.37 55.78,39.79 v55.78,41.38 | v56.45,29.61 56.45,29.32 56.46,29.31 56.46,29.3 54.95,27.79 54.95,24.69 55.2,24.44 55.2,21.32 54.88,21 v54.49,21
PD15/TIM4_CH4  (via drill 0.3)
  Top 0.18: v53.25,41.38 53.9,40.73 v53.9,29.62 v53.91,29.61 | IC1.62 v51.51,21.5
  Bottom 0.18: X3.33 v53.25,41.38 | v53.91,29.61 53.91,29.12 53.25,28.46 53.25,26.07 52.59,25.41 52.59,22.58 v51.51,21.5
PE0  (via drill 0.3)
  Top 0.18: v38.01,41.38 38.66,40.73 38.66,37.65 40.5,35.81 IC1.97
  Bottom 0.18: X3.9 v38.02,41.38 v38.01,41.38
PE1  (via drill 0.3)
  Top 0.18: v38.02,38.04 38.02,37.65 40,35.67 IC1.98
  Bottom 0.18: X3.10 v38.02,38.03 v38.02,38.04
PE2  (via drill 0.3)
  Top 0.18: IC1.1 37.84,28 37.95,28.11 37.95,28.71 36.74,29.92 v36.74,38.04
  Bottom 0.18: v36.74,38.04 X3.8
PE3  (via drill 0.3)
  Top 0.18: v36.74,41.38 37.38,40.74 37.38,37.68 37.19,37.49 37.19,30.05 38.34,28.9 38.34,27.9 37.93,27.49 IC1.2
  Bottom 0.18: X3.7 v36.74,41.38
PE4  (via drill 0.3)
  Top 0.18: v35.49,38.04 35.49,35.33 35.51,35.33 35.88,34.96 35.88,27.24 36.12,27 IC1.3
  Bottom 0.18: X3.6 35.48,38.02 v35.49,38.04
PE5  (via drill 0.3)
  Top 0.18: v35.51,41.38 36.12,40.77 36.12,35.58 36.15,35.51 36.31,35.36 36.3,29.46 v36.74,29.02 | IC1.4 v38.45,26.5
  Bottom 0.18: X3.5 35.51,39.81 v35.51,41.38 | v38.45,26.5 36.74,28.21 v36.74,29.02
PE6  (via drill 0.3)
  Top 0.18: IC1.5 35.2,26 34.95,26.25 34.95,28.52 34.24,29.23 v34.22,38.04
  Bottom 0.18: X3.4 34.2,38.01 v34.22,38.04
PE7  (via drill 0.3)
  Top 0.18: v45.64,6 45.64,6.38 45,7.02 IC1.38
  Bottom 0.18: X4.21 v45.63,6 v45.64,6
PE8  (via drill 0.3)
  Top 0.18: v45.65,2.62 46.28,3.25 46.28,6.39 45.5,7.17 IC1.39
  Bottom 0.18: X4.22 45.65,4.21 v45.65,2.62
PE9  (via drill 0.3)
  Top 0.18: v46.91,6 46.91,6.39 45.99,7.31 IC1.40
  Bottom 0.18: X4.23 v46.91,6
PE10  (via drill 0.3)
  Top 0.18: v46.92,2.62 47.56,3.26 47.56,6.37 46.5,7.43 IC1.41
  Bottom 0.18: X4.24 v46.92,2.62
PE11  (via drill 0.3)
  Top 0.18: v48.18,6 48.18,6.37 47,7.55 IC1.42
  Bottom 0.18: X4.25 v48.17,6 v48.18,6
PE12  (via drill 0.3)
  Top 0.18: v48.2,2.62 48.82,3.24 48.82,6.35 47.5,7.67 IC1.43
  Bottom 0.18: X4.26 48.2,4.2 v48.2,2.62
PE13  (via drill 0.3)
  Top 0.18: IC1.44 48,12.73 47.9,12.63 47.9,11.02 v48.14,10.78 | v57.29,10.89 58.06,10.89 58.25,11.08 58.99,11.08 59.33,10.74 59.33,10.07 58.83,9.57 RN2.7
  Bottom 0.18: v57.29,10.89 50.03,10.91 49.56,10.44 48.55,10.44 48.21,10.78 v48.14,10.78
PE14  (via drill 0.3)
  Top 0.18: IC1.45 48.5,12.55 48.34,12.39 48.34,11.76 v49.03,11.07 48.71,11.39 | v58,11.8 58.98,11.8 59.85,10.93 59.85,9.95 59.63,9.73 RN2.6
  Bottom 0.18: v49.03,11.07 49.52,11.07 49.81,11.36 56.69,11.36 57.13,11.8 v58,11.8
PE15  (via drill 0.3)
  Top 0.18: IC1.46 49,12.04 v49.06,11.98 | T1.5 62.98,10.21 62.65,10.54 61.77,10.54 61.31,11 60.52,11 58.93,12.59 v58.54,12.59
  Bottom 0.18: v49.06,11.98 49.3,11.98 49.54,11.74 56.35,11.74 57.2,12.59 v58.54,12.59
USB_VDD  (via drill 0.3)
  Top 0.254: C8.1 19.51,29.48 | 17.6,29.5 17.32,29.22 IC2.5 | v57.92,20.42 R9.1 | v58.56,30.45 58.57,34.16 v58.55,34.18 | 22,31.62 v22.02,31.6
  Top 0.406: 20.08,31.62 22,31.62
  Top 1.016: 17.6,29.5 17.62,29.48 19.51,29.48 20.08,30.05 20.08,31.62 Z1.P$1 20.08,35.11 20.95,35.98 JP3.1
  Bottom 0.254: v58.55,34.18 58.53,34.18 58.37,34.34 29.62,34.34 29.17,33.89 26.06,33.89 23.77,31.6 v22.02,31.6 | v58.56,30.45 58.33,30.22 58.33,25.8 58.13,25.6 58.13,24.12 57.92,23.91 v57.92,20.42

### Text on the board
tPlace: J1 | BOOT0 | J2 | RESET | J3 | USBPWR | STeameR ver 1.1 | (C) STC Metrotek, 2011